# EAGLE schematic Arduino MEGA DRAM Tester 2 (EAGLE 9.5.0)
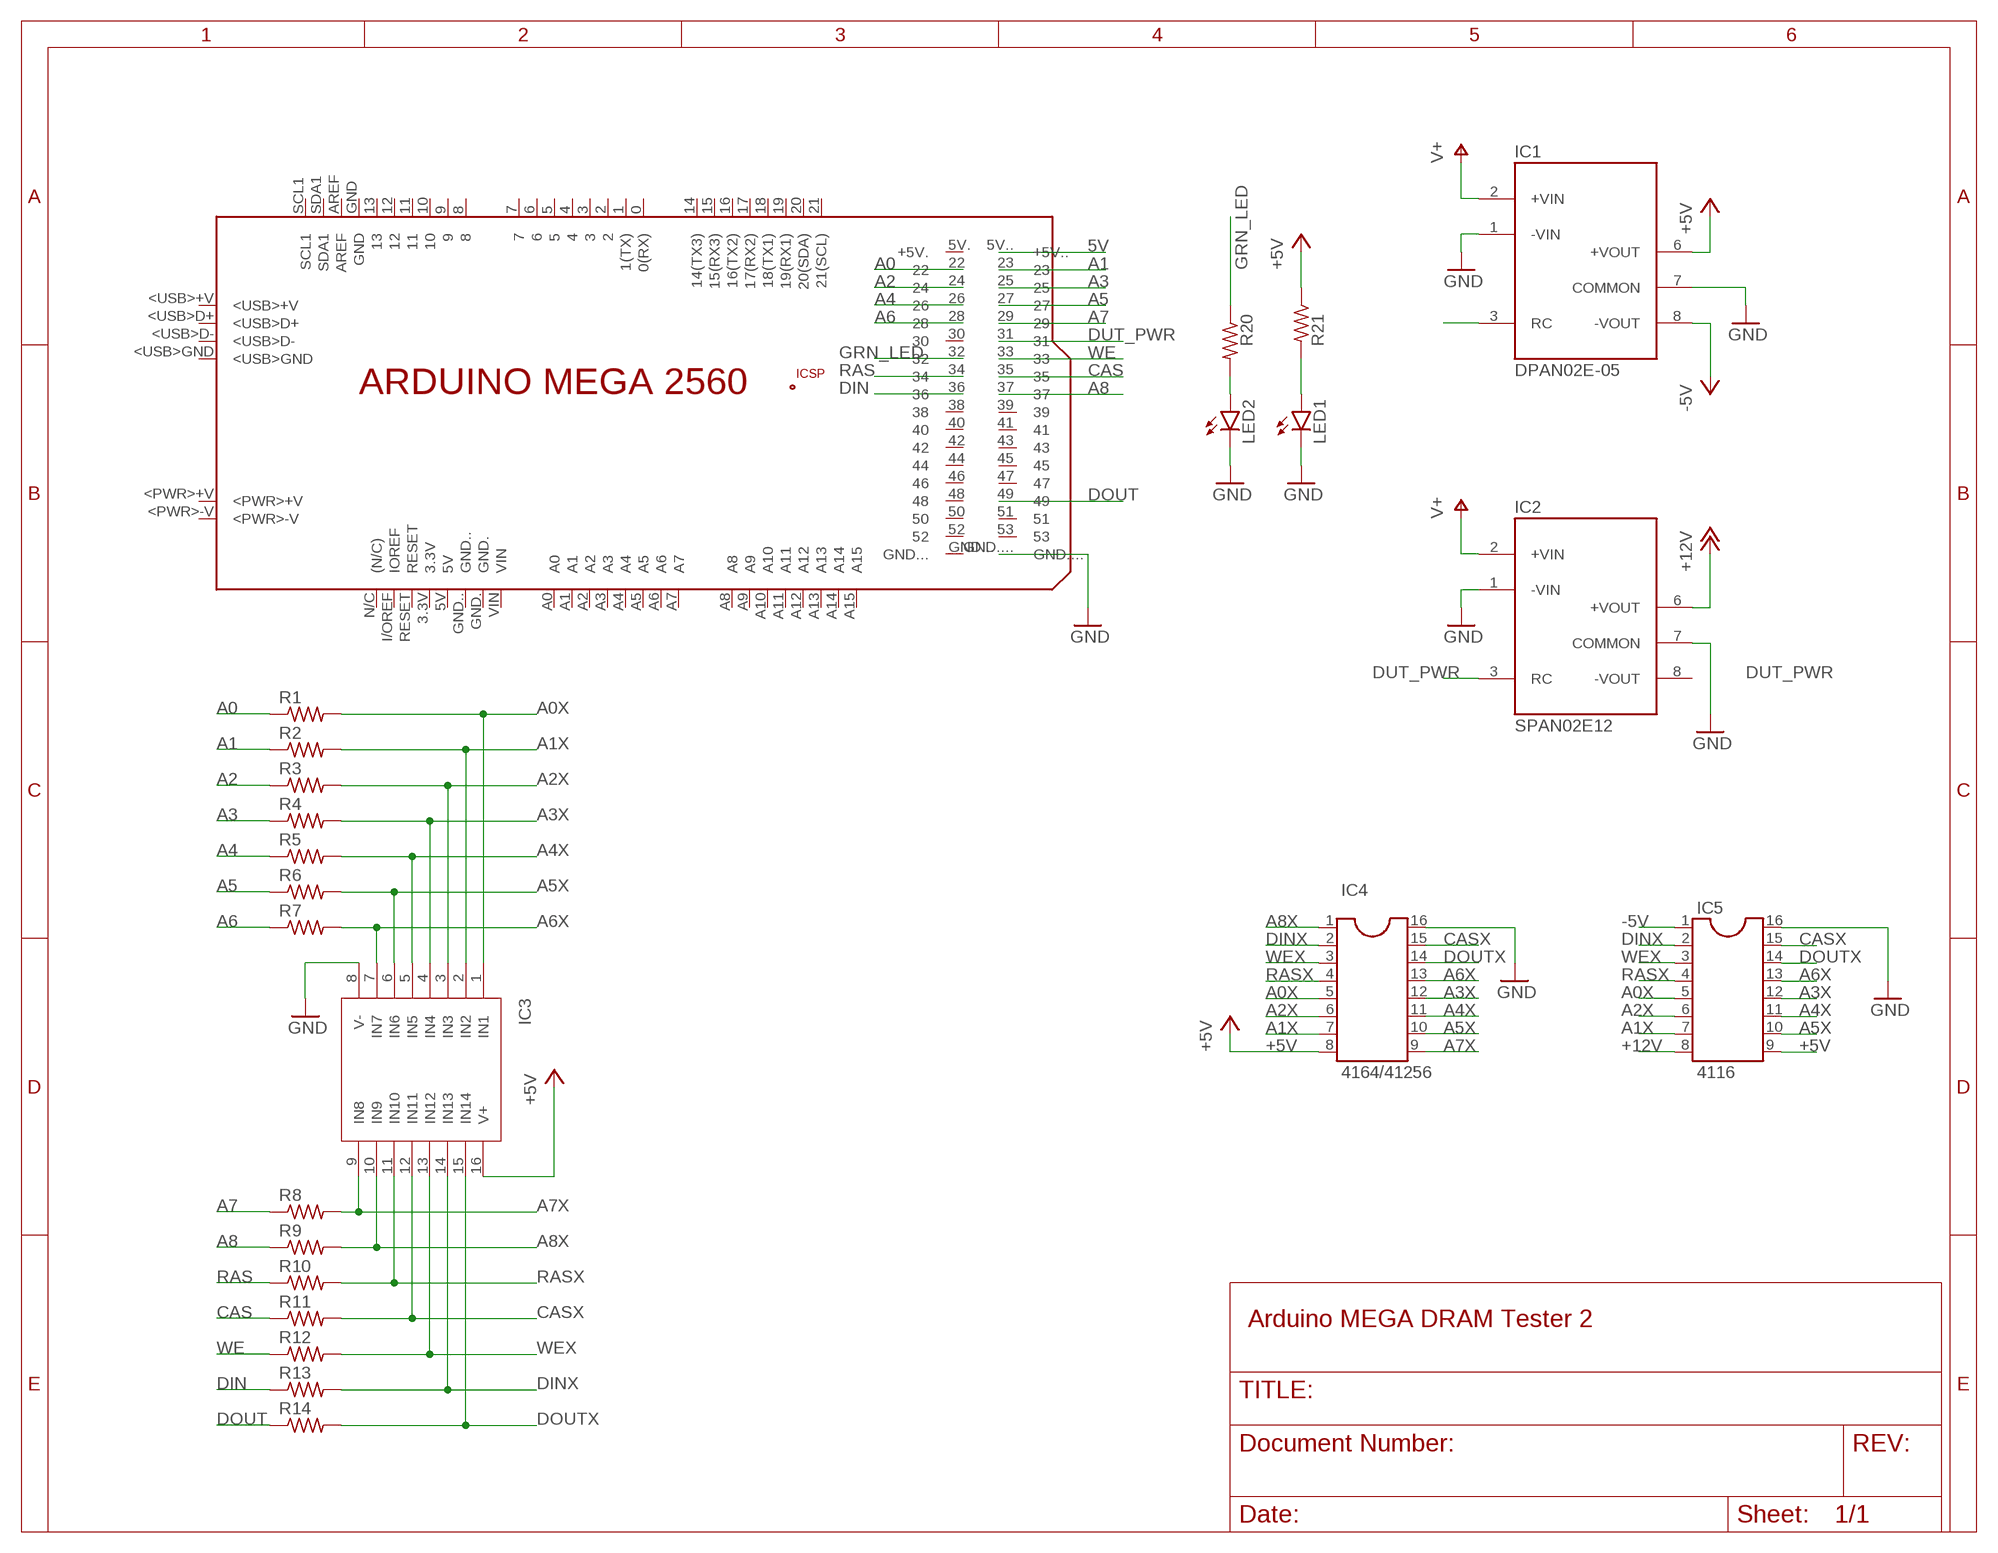
[diagram p0: schematic, sheet 1]

## Parts
IC1  DPAN02E-05  DPAN02  [SIP7]
IC2  SPAN02E12  DPAN02  [SIP7]
IC3  SP720  [DIL16]
IC4  4164/41256  DIL16  [DIL16]
IC5  4116  DIL16S  [SOCKET-16]
LED1  LED5MM  [LED5MM]
LED2  LED5MM  [LED5MM]
PCB1  ARDUINO_MEGA2560  [ARDUINO_MEGA2560]
R1  R-US_V235/17  [V235/17]
R2  R-US_V235/17  [V235/17]
R3  R-US_V235/17  [V235/17]
R4  R-US_V235/17  [V235/17]
R5  R-US_V235/17  [V235/17]
R6  R-US_V235/17  [V235/17]
R7  R-US_V235/17  [V235/17]
R8  R-US_V235/17  [V235/17]
R9  R-US_V235/17  [V235/17]
R10  R-US_V235/17  [V235/17]
R11  R-US_V235/17  [V235/17]
R12  R-US_V235/17  [V235/17]
R13  R-US_V235/17  [V235/17]
R14  R-US_V235/17  [V235/17]
R20  R-US_0309/10  [0309/10]
R21  R-US_0309/10  [0309/10]

## Nets
5V: PCB1.5V..(+5V..)
+5V: IC1.6(+VOUT) IC3.16(V+) IC4.8 IC5.9 R21.1
+12V: IC2.6(+VOUT) IC5.8
-5V: IC1.8(-VOUT) IC5.1
A0: PCB1.22 R1.1
A0X: IC3.1(IN1) IC4.5 IC5.5 R1.2
A1: PCB1.23 R2.1
A1X: IC3.2(IN2) IC4.7 IC5.7 R2.2
A2: PCB1.24 R3.1
A2X: IC3.3(IN3) IC4.6 IC5.6 R3.2
A3: PCB1.25 R4.1
A3X: IC3.4(IN4) IC4.12 IC5.12 R4.2
A4: PCB1.26 R5.1
A4X: IC3.5(IN5) IC4.11 IC5.11 R5.2
A5: PCB1.27 R6.1
A5X: IC3.6(IN6) IC4.10 IC5.10 R6.2
A6: PCB1.28 R7.1
A6X: IC3.7(IN7) IC4.13 IC5.13 R7.2
A7: PCB1.29 R8.1
A7X: IC3.9(IN8) IC4.9 R8.2
A8: PCB1.37 R9.1
A8X: IC3.10(IN9) IC4.1 R9.2
CAS: PCB1.35 R11.1
CASX: IC3.12(IN11) IC4.15 IC5.15 R11.2
DIN: PCB1.36 R13.1
DINX: IC3.14(IN13) IC4.2 IC5.2 R13.2
DOUT: PCB1.49 R14.1
DOUTX: IC3.15(IN14) IC4.14 IC5.14 R14.2
DUT_PWR: IC1.3(RC) IC2.3(RC) PCB1.31
GND: IC1.1(-VIN) IC1.7(COMMON) IC2.1(-VIN) IC2.7(COMMON) IC3.8(V-) IC4.16 IC5.16 LED1.K(C) LED2.K(C) PCB1.GND....
GRN_LED: PCB1.32 R20.1
N$6: LED1.A R21.2
N$20: LED2.A R20.2
RAS: PCB1.34 R10.1
RASX: IC3.11(IN10) IC4.4 IC5.4 R10.2
V+: IC1.2(+VIN) IC2.2(+VIN)
WE: PCB1.33 R12.1
WEX: IC3.13(IN12) IC4.3 IC5.3 R12.2
Unconnected: IC2.8(-VOUT) PCB1.0(0(RX)) PCB1.1(1(TX)) PCB1.2 PCB1.3 PCB1.3.3V PCB1.4 PCB1.5 PCB1.5V PCB1.5V.(+5V.) PCB1.6 PCB1.7 PCB1.8 PCB1.9 PCB1.10 PCB1.11 PCB1.12 PCB1.13 PCB1.14(14(TX3)) PCB1.15(15(RX3)) PCB1.16(16(TX2)) PCB1.17(17(RX2)) PCB1.18(18(TX1)) PCB1.19(19(RX1)) PCB1.20(20(SDA)) PCB1.21(21(SCL)) PCB1.30 PCB1.38 PCB1.39 PCB1.40 PCB1.41 PCB1.42 PCB1.43 PCB1.44 PCB1.45 PCB1.46 PCB1.47 PCB1.48 PCB1.50 PCB1.51 PCB1.52 PCB1.53 PCB1.+5V_ PCB1.<PWR>+V PCB1.<PWR>-V PCB1.<USB>+V PCB1.<USB>D+ PCB1.<USB>D- PCB1.<USB>GND PCB1.A0 PCB1.A1 PCB1.A2 PCB1.A3 PCB1.A4 PCB1.A5 PCB1.A6 PCB1.A7 PCB1.A8 PCB1.A9 PCB1.A10 PCB1.A11 PCB1.A12 PCB1.A13 PCB1.A14 PCB1.A15 PCB1.AREF PCB1.GND PCB1.GND. PCB1.GND.. PCB1.GND... PCB1.GND__ PCB1.I/OREF(IOREF) PCB1.MISO PCB1.MOSI PCB1.N/C((N/C)) PCB1.RESET PCB1.RESET. PCB1.SCK PCB1.SCL1 PCB1.SDA1 PCB1.VIN

## Library data of the parts
IC1 IC2 = MW DPAN02:DPAN02
IC3 = Littlefuse:SP720
IC4 IC5 = ic-package:DIL16: Dual In Line / Socket
LED1 LED2 = led:LED: LED OSRAM: - CHIPLED LG R971, LG N971, LY N971, LG Q971, LY Q971, LO R971, LY R971 LH N974, LH R974 LS Q976, LO Q976, LY Q976 LO Q996 - Hyper CHIPLED LW Q18S LB Q993, LB Q99A, LB R99A - SideLED LS A670, LO A670, LY A670, LG A670, LP A670 LB A673, LV A673, LT A673, LW A673 LH A674 LY A675 LS A676, LA A676, LO A676, LY A676, LW A676 LS A679, LY A679, LG A679 - Hyper Micro SIDELED® LS Y876, LA Y876, LO Y876, LY Y876 LT Y87S - SmartLED LW L88C, LW L88S LB L89C, LB L89S, LG L890 LS L89K, LO L89K, LY L89K LS L896, LA L896, LO L896, LY L896 - TOPLED LS T670, LO T670, LY T670, LG T670, LP T670 LSG T670, LSP T670, LSY T670, LOP T670, LYG T670 LG T671, LOG T671, LSG T671 LB T673, LV T673, LT T673, LW T673 LH T674 LS T676, LA T676, LO T676, LY T676, LB T676, LH T676, LSB T676, LW T676 LB T67C, LV T67C, LT T67C, LS T67K, LO T67K, LY T67K, LW E67C LS E67B, LA E67B, LO E67B, LY E67B, LB E67C, LV E67C, LT E67C LW T67C LS T679, LY T679, LG T679 LS T770, LO T770, LY T770, LG T770, LP T770 LB T773, LV T773, LT T773, LW T773 LH T774 LS E675, LA E675, LY E675, LS T675 LS T776, LA T776, LO T776, LY T776, LB T776 LHGB T686 LT T68C, LB T68C - Hyper Mini TOPLED® LB M676 - Mini TOPLED Santana® LG M470 LS M47K, LO M47K, LY M47K Source: http://www.osram.convergy.de LUXEON: - LUMILED® LXK2-PW12-R00, LXK2-PW12-S00, LXK2-PW14-U00, LXK2-PW14-V00 LXK2-PM12-R00, LXK2-PM12-S00, LXK2-PM14-U00 LXK2-PE12-Q00, LXK2-PE12-R00, LXK2-PE12-S00, LXK2-PE14-T00, LXK2-PE14-U00 LXK2-PB12-K00, LXK2-PB12-L00, LXK2-PB12-M00, LXK2-PB14-N00, LXK2-PB14-P00, LXK2-PB14-Q00 LXK2-PR12-L00, LXK2-PR12-M00, LXK2-PR14-Q00, LXK2-PR14-R00 LXK2-PD12-Q00, LXK2-PD12-R00, LXK2-PD12-S00 LXK2-PH12-R00, LXK2-PH12-S00 LXK2-PL12-P00, LXK2-PL12-Q00, LXK2-PL12-R00 Source: www.luxeon.com KINGBRIGHT: KA-3528ASYC Source: www.kingbright.com
PCB1 = E14_Arduino_revC:ARDUINO_MEGA2560: Device for representing an Arduino Mega 2560 board with a footprint in an EAGLE design. Created by Dave Young for Element14. More EAGLE documentation at: http://www.element14.com/community/community/knode/cadsoft_eagle
R1-R14 = rcl:R-US_: RESISTOR, American symbol; SPICEPREFIX: R
R20 R21 = resistor:R-US_: RESISTOR, American symbol